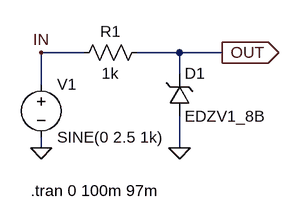
[diagram p0: schematic Limiter_Zener.asc]
Limiter_Zener.asc, the LTspice schematic file:
Version 4
SHEET 1 880 680
WIRE 176 64 112 64
WIRE 320 64 256 64
WIRE 384 64 320 64
WIRE 320 96 320 64
WIRE 112 112 112 64
WIRE 112 208 112 192
WIRE 320 208 320 160
FLAG 112 208 0
FLAG 320 208 0
FLAG 384 64 OUT
IOPIN 384 64 Out
FLAG 112 64 IN
SYMBOL voltage 112 96 R0
WINDOW 123 0 0 Left 2
WINDOW 39 0 0 Left 2
SYMATTR InstName V1
SYMATTR Value SINE(0 2.5 1k)
SYMBOL res 272 48 R90
WINDOW 0 0 56 VBottom 2
WINDOW 3 32 56 VTop 2
SYMATTR InstName R1
SYMATTR Value 1k
SYMBOL zener 304 160 M180
WINDOW 0 24 64 Left 2
WINDOW 3 24 0 Left 2
SYMATTR InstName D1
SYMATTR Value EDZV1_8B
TEXT 96 272 Left 2 !.tran 0 100m 97m

The netlist it stands for:
* Limiter_Zener.asc
V1 IN 0 SINE(0 2.5 1k)
R1 OUT IN 1k
D1 0 OUT EDZV1_8B
.model D D
.lib standard.dio
.tran 0 100m 97m
.backanno
.end